# Altium schematic sheet sd-card.SchDoc
size A
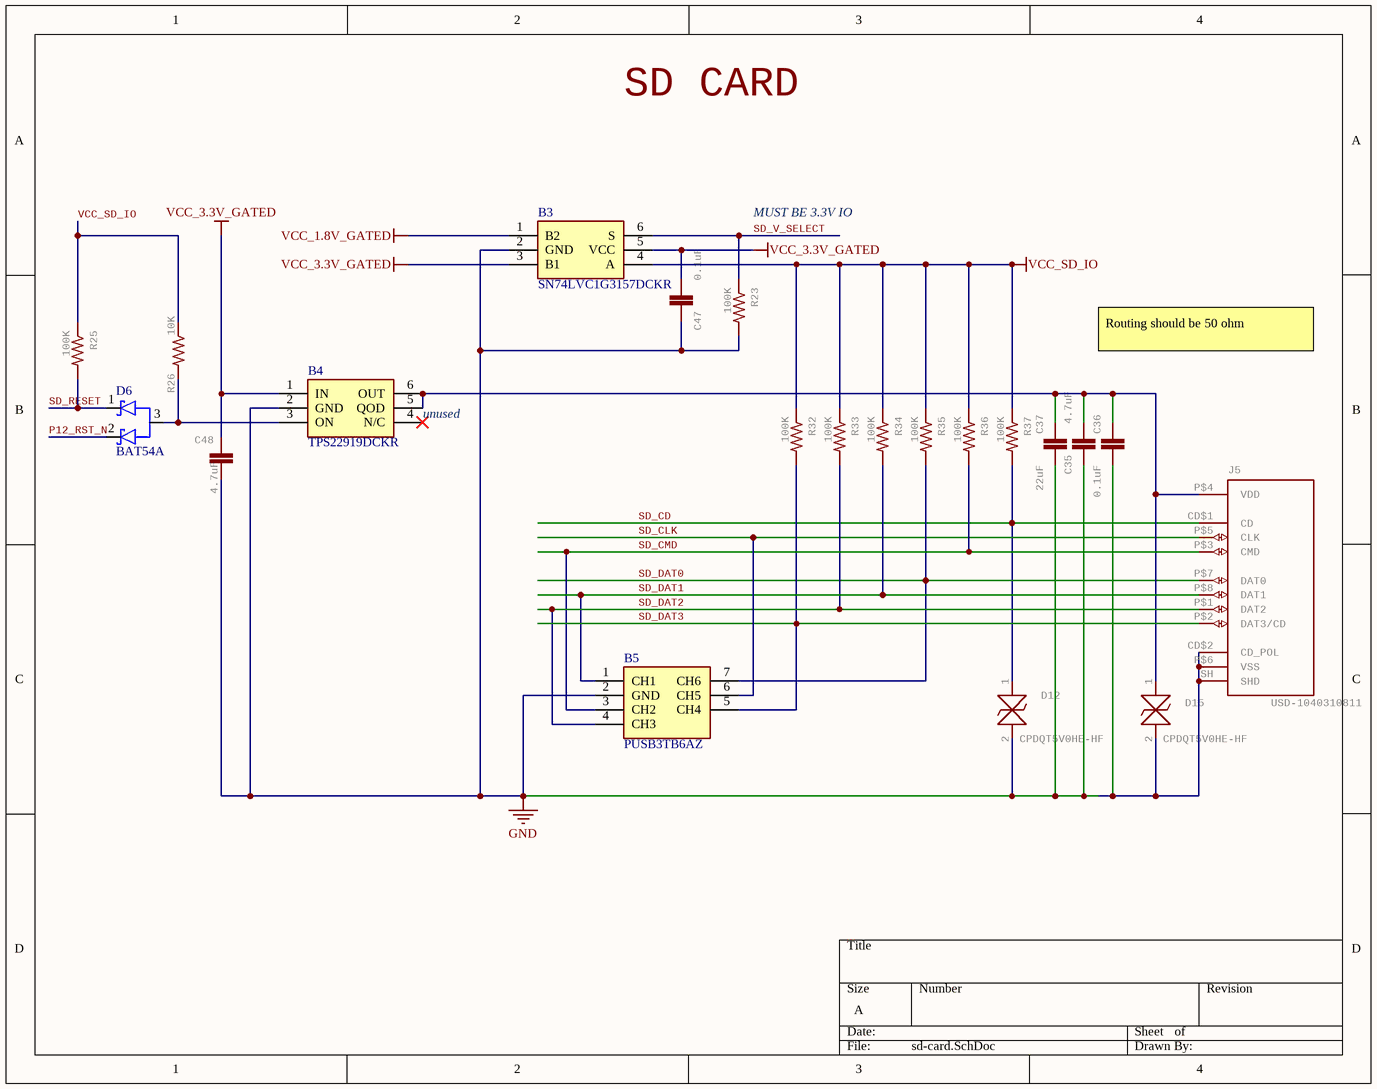
[diagram p0: sd-card.SchDoc]

## Parts
B3  SN74LVC1G3157DCKR  [SOT65P210X110-6N]
B4  TPS22919DCKR  [SOT65P210X110-6N]
B5  PUSB3TB6AZ  [PUSB3TB6AZ]
C35  4.7uF  [0402-CAP]
C36  0.1uF  [0402-CAP]
C37  22uF  [0805]
C47  0.1uF  [0402-CAP]
C48  4.7uF  [0402-CAP]
D6  BAT54A  [SOT65P210X110-3N]
D12  CPDQT5V0HE-HF  [CPDQT5V0HEHF]
D15  CPDQT5V0HE-HF  [CPDQT5V0HEHF]
J5  USD-1040310811  [1040310811]
R23  100K  [0402-RES]
R25  100K  [0402-RES]
R26  10K  [0402-RES]
R32  100K  [0402-RES]
R33  100K  [0402-RES]
R34  100K  [0402-RES]
R35  100K  [0402-RES]
R36  100K  [0402-RES]
R37  100K  [0402-RES]

## Nets
GND: B3.2(GND) B4.2(GND) B5.2(GND) C35.1 C36.2 C37.2 C47.1 C48.2 D12.2 D15.2 J5.CD$2(CD_POL) J5.P$6(VSS) J5.SH(SHD) R23.2
VCC_1.8V_GATED: B3.1(B2)
VCC_3.3V_GATED: B3.3(B1) B3.5(VCC) B4.1(IN) C47.2 C48.1
VCC_SD_IO: B3.4(A) R25.1 R26.1 R32.1 R33.1 R34.1 R35.1 R36.1 R37.1
P12_RST_N: D6.2(C2)
SD_CD: D12.1 J5.CD$1(CD) R37.2
SD_CLK: B5.6(CH5) J5.P$5(CLK)
SD_CMD: B5.3(CH2) J5.P$3(CMD) R36.2
SD_DAT0: B5.7(CH6) J5.P$7(DAT0) R35.2
SD_DAT1: B5.1(CH1) J5.P$8(DAT1) R34.2
SD_DAT2: B5.4(CH3) J5.P$1(DAT2) R33.2
SD_DAT3: B5.5(CH4) J5.P$2(DAT3/CD) R32.2
SD_RESET: D6.1(C1) R25.2
SD_V_SELECT: B3.6(S) R23.1
NetB4_3: B4.3(ON) D6.3(CA) R26.2
NetB4_5: B4.5(QOD) B4.6(OUT) C35.2 C36.1 C37.1 D15.1 J5.P$4(VDD)

Not connected (* = marked no-connect by the designer): B4 4(N/C)*

## Notes on the sheet
- SD CARD
- MUST BE 3.3V IO
- Routing should be 50 ohm
- (near B4) unused

## Library data of the parts
B3 = SN74LVC1G3157DCKR: SN74LVC1G3157DCKR, Analogue Switch Single SPDT, 3, 5V, 6-Pin, SC-70; Manufacturer_Name: Texas Instruments; Geometry.Height: 1.1mm; Mouser Part Number: 595-SN74LVC1G3157DCK; Mouser Price/Stock: https://www.mouser.co.uk/ProductDetail/Texas-Instruments/SN74LVC1G3157DCKR?qs=PVVDbbWpW3J21wbz0QWbxg%3D%3D; Manufacturer_Part_Number: SN74LVC1G3157DCKR; Datasheet Link: http://www.ti.com/lit/ds/symlink/sn74lvc1g3157.pdf; Part Number: SN74LVC1G3157DCKR; MPN: SN74LVC1G3157DCKR
B4 = TPS22919DCKR: 5.5V, 1.5A, 90m self-protected load switch with controlled rise time; Manufacturer_Name: Texas Instruments; Geometry.Height: 1.1mm; Mouser Part Number: 595-TPS22919DCKR; Mouser Price/Stock: https://www.mouser.co.uk/ProductDetail/Texas-Instruments/TPS22919DCKR?qs=byeeYqUIh0P8WJZpeizUqw%3D%3D; Manufacturer_Part_Number: TPS22919DCKR; Datasheet Link: http://www.ti.com/lit/ds/symlink/tps22919.pdf; Part Number: TPS22919DCKR; MPN: TPS22919DCKR
B5 = PUSB3TB6AZ: NEXPERIA - PUSB3TB6AZ - DIODE, ESD PROTECTION, 5.5V, 0.27PF; Geometry.Height: 0.5mm; Mouser Part Number: 771-PUSB3TB6AZ; Mouser Price/Stock: https://www.mouser.co.uk/ProductDetail/Nexperia/PUSB3TB6AZ?qs=K2OaAKmNuLgsAI4MRas6Xw%3D%3D; Manufacturer_Name: Nexperia; Manufacturer_Part_Number: PUSB3TB6AZ; Datasheet Link: https://assets.nexperia.com/documents/data-sheet/PUSB3TB6.pdf; Part Number: PUSB3TB6AZ; MPN: PUSB3TB6AZ
C35 C48 = CAP0402-CAP: CapacitorStandard 0603 ceramic capacitor, and 0.1" leaded capacitor.; MPN: JMK105BBJ475MV-F; GateName_1: G$1; SymbolName_1: CAP; DeviceName: 0402-CAP; LibraryName: sfe; DeviceSetName: CAP; Part Number: JMK105BBJ475MV-F
C36 C47 = C-EUC0201: CAPACITOR, European symbol; MPN: C0402C104Z4VAC; GateName_1: G$1; SymbolName_1: C-EU; POPULARITY: 0; LibraryName: rcl; DeviceSetName: C-EU; SPICEPREFIX: C; Part Number: C0402C104Z4VAC
C37 = 22UF-0805-6.3V-20%: 22ÂµF ceramic capacitors    A capacitor is a passive two-terminal electrical component used to store electrical energy temporarily in an electric field.; MPN: CL21A226MQQNNNE; GateName_1: G$1; SymbolName_1: CAP; PROD_ID: CAP-08402; DeviceName: -0805-6.3V-20%; LibraryName: SparkFun-Capacitors; DeviceSetName: 22UF; Part Number: CL21A226MQQNNNE
D6 = BAT54AW-7-F: Diode Array 1 Pair Common Anode Schottky 30V 200mA (DC) Surface Mount SC-70, SOT-323; Part Number: BAT54AW,115; Package: None; Source: BAT54AW-7-F.SchLib; Availability: Unavailable; Price: None; MP: BAT54A; Value: *; Design Item ID: BAT54A; Component Type: Standard; Pin Count: 3; MPN: BAT54AW,115
D12 D15 = CPDQT5V0HE-HF: ESD Suppressors / TVS Diodes DIODE ESD 5VWM 65W 0402/SOD-923F   Source:  Datasheet; MANUFACTURER_NAME: Comchip Technology; GateName_1: G$1; SymbolName_1: CPDQT5V0HE-HF; LibraryName: CPDQT5V0HE-HF; DeviceSetName: CPDQT5V0HE-HF; HEIGHT: 0.42mm; MANUFACTURER_PART_NUMBER: CPDQT5V0HE-HF; MOUSER_PART_NUMBER: MOUSER_PART_NUMBER; MOUSER_PRICE-STOCK: MOUSER_PRICE-STOCK; MPN: CPDQT5V0HE-HF; Part Number: CPDQT5V0HE-HF
J5 = USD-1040310811: uSD Slot; MPN: 104031-0811; GateName_1: G$1; SymbolName_1: USD; LibraryName: 1040310811; DeviceSetName: USD-1040310811; Part Number: 104031-0811
R23 R25 R32-R37 = RESISTOR0402-RES: ResistorBasic schematic elements and footprints for 0603, 1206, and PTH resistors.; MPN: AC0402FR-07100KL; GateName_1: G$1; SymbolName_1: RESISTOR; DeviceName: 0402-RES; LibraryName: sfe; DeviceSetName: RESISTOR; Part Number: AC0402FR-07100KL
R26 = RESISTOR0402-RES: ResistorBasic schematic elements and footprints for 0603, 1206, and PTH resistors.; MPN: AC0402FR-1310K; GateName_1: G$1; SymbolName_1: RESISTOR; DeviceName: 0402-RES; LibraryName: sfe; DeviceSetName: RESISTOR; Part Number: AC0402FR-1310K